# EAGLE design Buck Regulator_secondary (EAGLE 9.6.2)

## Sheet 1 of 2: Datasheet
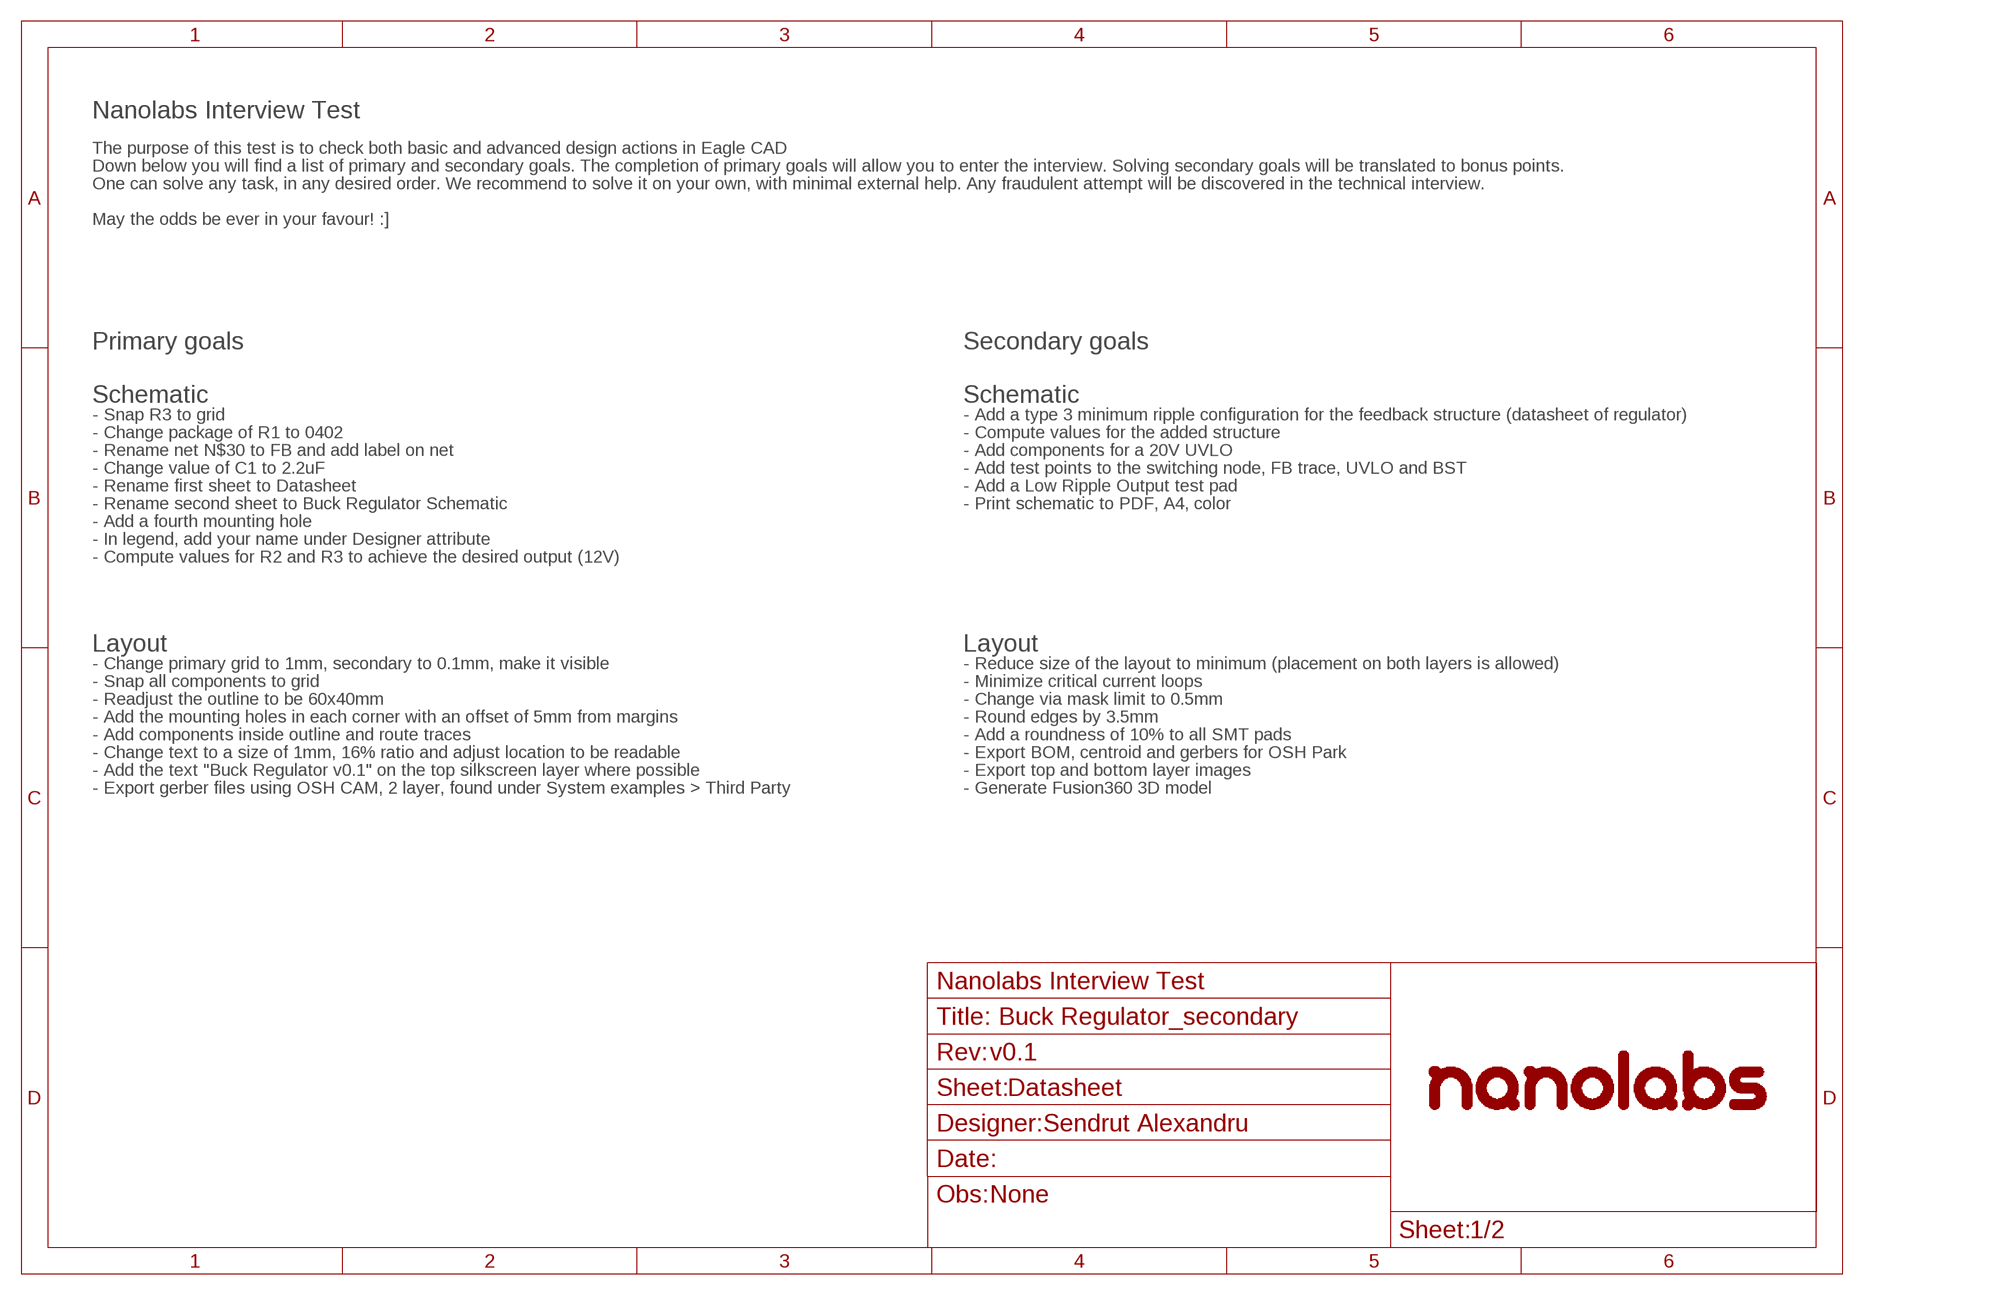
[diagram p0: schematic, sheet 1]
FRAME3 (_SCH_FRAME_A4): DNAME: Sendrut Alexandru; OBS: None; REVNUM: v0.1

### Notes on the sheet
- Nanolabs Interview Test
- The purpose of this test is to check both basic and advanced design actions in Eagle CAD
- Down below you will find a list of primary and secondary goals. The completion of primary goals will allow you to enter the interview. Solving secondary goals will be translated to bonus points.
- One can solve any task, in any desired order. We recommend to solve it on your own, with minimal external help. Any fraudulent attempt will be discovered in the technical interview.
- May the odds be ever in your favour! :]
- Primary goals | Secondary goals
- Schematic | Schematic
- - Snap R3 to grid | - Add a type 3 minimum ripple configuration for the feedback structure (datasheet of regulator)
- - Change package of R1 to 0402 | - Compute values for the added structure
- - Rename net N$30 to FB and add label on net | - Add components for a 20V UVLO
- - Change value of C1 to 2.2uF | - Add test points to the switching node, FB trace, UVLO and BST
- - Rename first sheet to Datasheet | - Add a Low Ripple Output test pad
- - Rename second sheet to Buck Regulator Schematic | - Print schematic to PDF, A4, color
- - Add a fourth mounting hole
- - In legend, add your name under Designer attribute
- - Compute values for R2 and R3 to achieve the desired output (12V)
- Layout | Layout
- - Change primary grid to 1mm, secondary to 0.1mm, make it visible | - Reduce size of the layout to minimum (placement on both layers is allowed)
- - Snap all components to grid | - Minimize critical current loops
- - Readjust the outline to be 60x40mm | - Change via mask limit to 0.5mm
- - Add the mounting holes in each corner with an offset of 5mm from margins | - Round edges by 3.5mm
- - Add components inside outline and route traces | - Add a roundness of 10% to all SMT pads
- - Change text to a size of 1mm, 16% ratio and adjust location to be readable | - Export BOM, centroid and gerbers for OSH Park
- - Add the text "Buck Regulator v0.1" on the top silkscreen layer where possible | - Export top and bottom layer images
- - Export gerber files using OSH CAM, 2 layer, found under System examples > Third Party | - Generate Fusion360 3D model

## Sheet 2 of 2: Buck Regulator Schematic
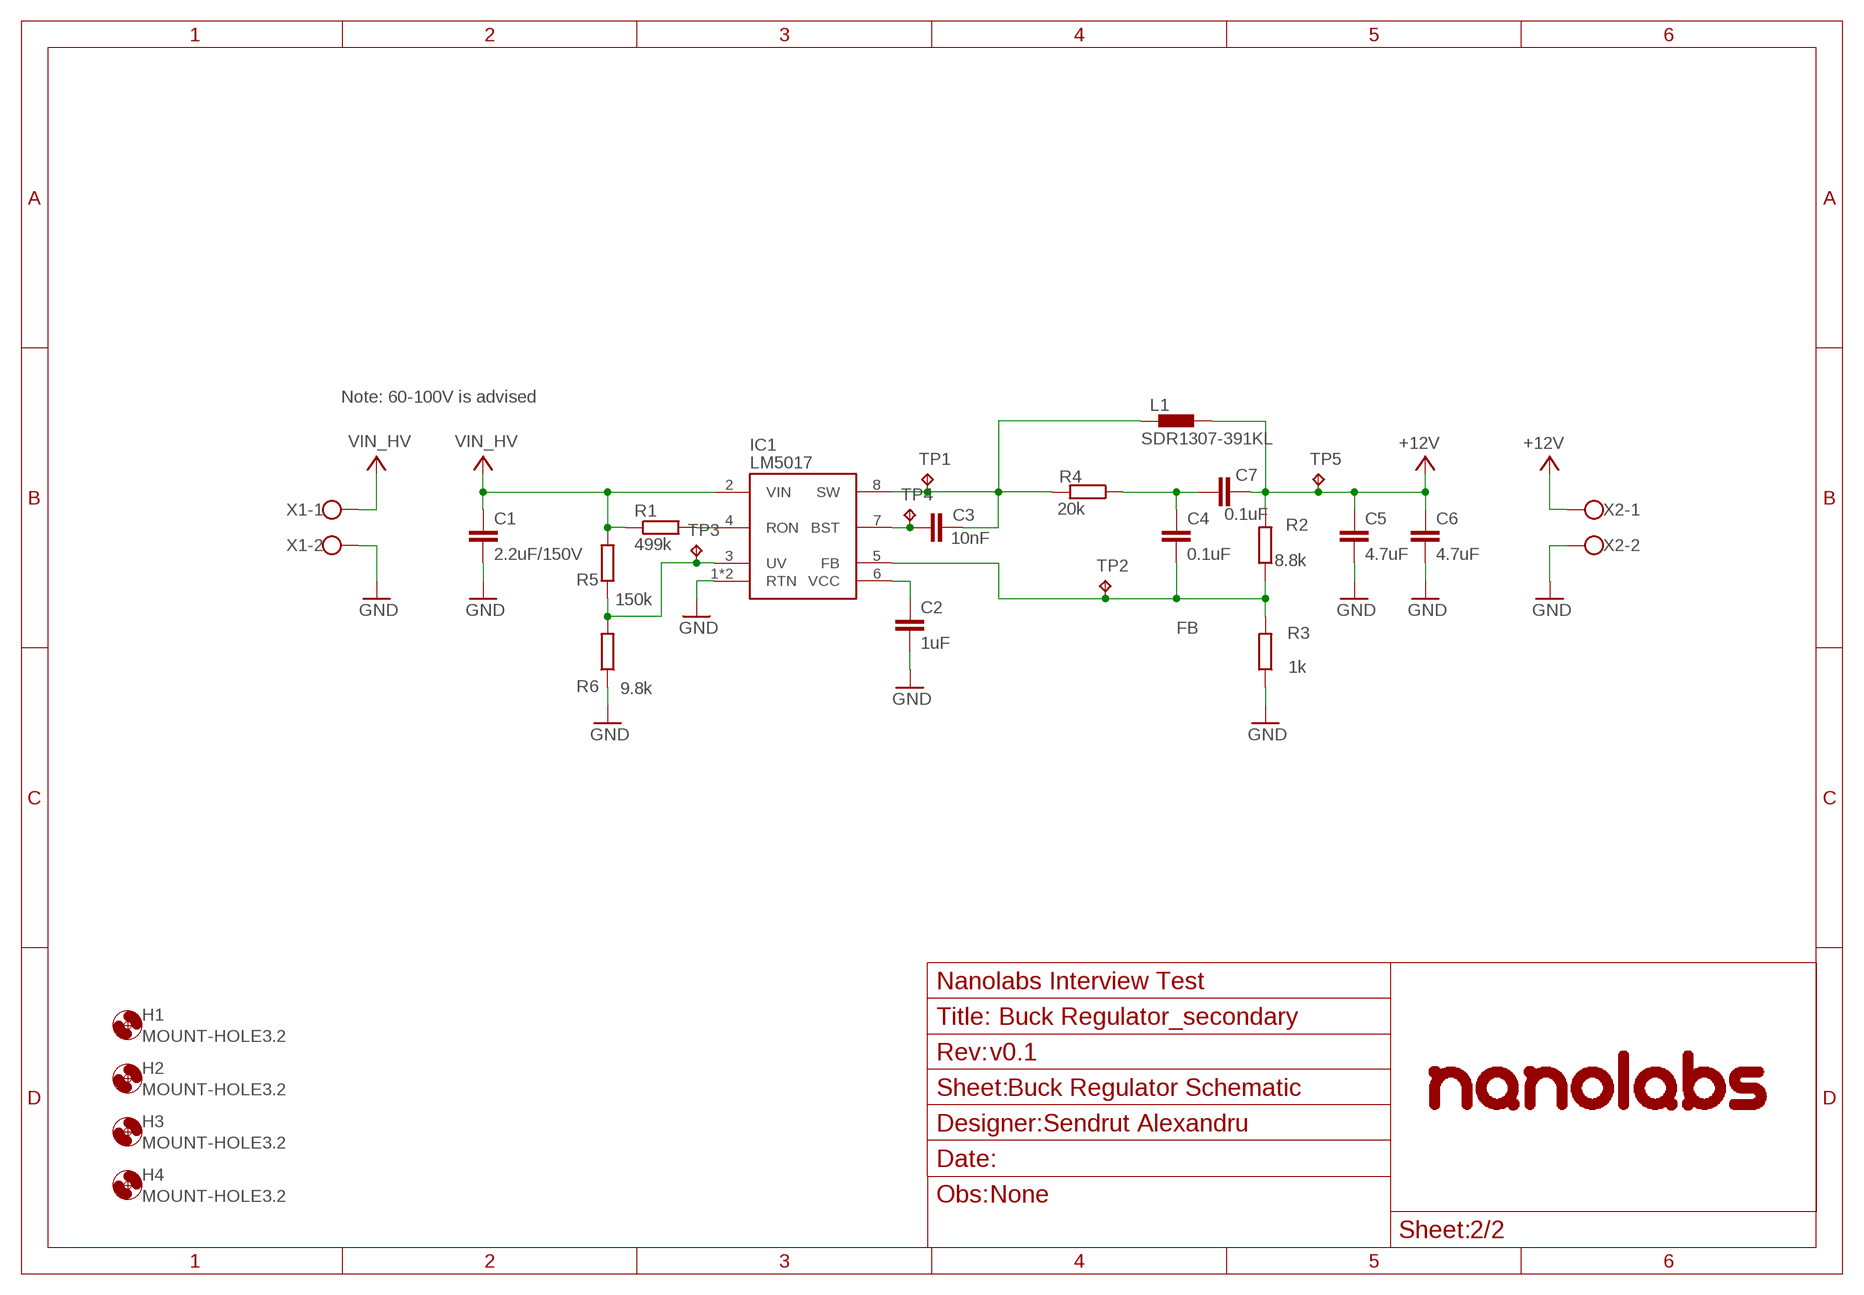
[diagram p1: schematic, sheet 2]
FRAME1 (_SCH_FRAME_A4): DNAME: Sendrut Alexandru; OBS: None; REVNUM: v0.1

### Parts
C1  2.2uF/150V  C-EUC1812  [C1812]
C2  1uF  C-EUC0603  [C0603]
C3  10nF  C-EUC0603  [C0603]
C4  0.1uF  C-EUC0603  [C0603]
C5  4.7uF  C-EUC0603  [C0603]
C6  4.7uF  C-EUC0603  [C0603]
C7  0.1uF  C-EUC0603  [C0603]
H1  MOUNT-HOLE3.2  [3,2]
H2  MOUNT-HOLE3.2  [3,2]
H3  MOUNT-HOLE3.2  [3,2]
H4  MOUNT-HOLE3.2  [3,2]
IC1  LM5017  [SO-08-EP]
L1  SDR1307-391KL  [SDR1307-391KL]
R1  499k  R-EU_R0402  [R0402]
R2  8.8k  R-EU_R0603  [R0603]
R3  1k  R-EU_R0603  [R0603]
R4  20k  R-EU_R0603  [R0603]
R5  150k  R-EU_R0402  [R0402]
R6  9.8k  R-EU_R0402  [R0402]
TP1  TPB1,27  [B1,27]
TP2  TPB1,27  [B1,27]
TP3  TPB1,27  [B1,27]
TP4  TPB1,27  [B1,27]
TP5  TPB1,27  [B1,27]
X1  W237-102  [W237-102]
X2  W237-102  [W237-102]

### Nets
+12V: C5.1 C6.1 C7.2 L1.2 R2.2 TP5.TP X2.1
FB: C4.2 IC1.5(FB) R2.1 R3.2 TP2.TP
GND: C1.2 C2.2 C5.2 C6.2 IC1.1(RTN) IC1.9(RTN) R3.1 R6.1 X1.2 X2.2
N$1: C4.1 C7.1 R4.1
N$2: IC1.3(UV) R5.1 R6.2 TP3.TP
N$23: C2.1 IC1.6(VCC)
N$28: C3.1 IC1.7(BST) TP4.TP
N$29: C3.2 IC1.8(SW) L1.1 R4.2 TP1.TP
N$31: IC1.4(RON) R1.2
VIN_HV: C1.1 IC1.2(VIN) R1.1 R5.2 X1.1

### Notes on the sheet
- Note: 60-100V is advised

## Library data of the parts
C1-C7 = rcl:C-EU: CAPACITOR, European symbol; SPICEPREFIX: C
H1-H4 = _nanolabs_layout:MOUNT-HOLE: MOUNTING HOLE with drill center marker
IC1 = _nanolabs_ic:LM5017
L1 = _nanolabs_rcl:SDR1307-391KL
R1-R6 = rcl:R-EU_: RESISTOR, European symbol; SPICEPREFIX: R
TP1-TP5 = testpad:TP: Test pad
X1 X2 = con-wago-500:W237-102: WAGO SCREW CLAMP; MPN: 237-102; OC_FARNELL: unknown; OC_NEWARK: 70K9898

## Board
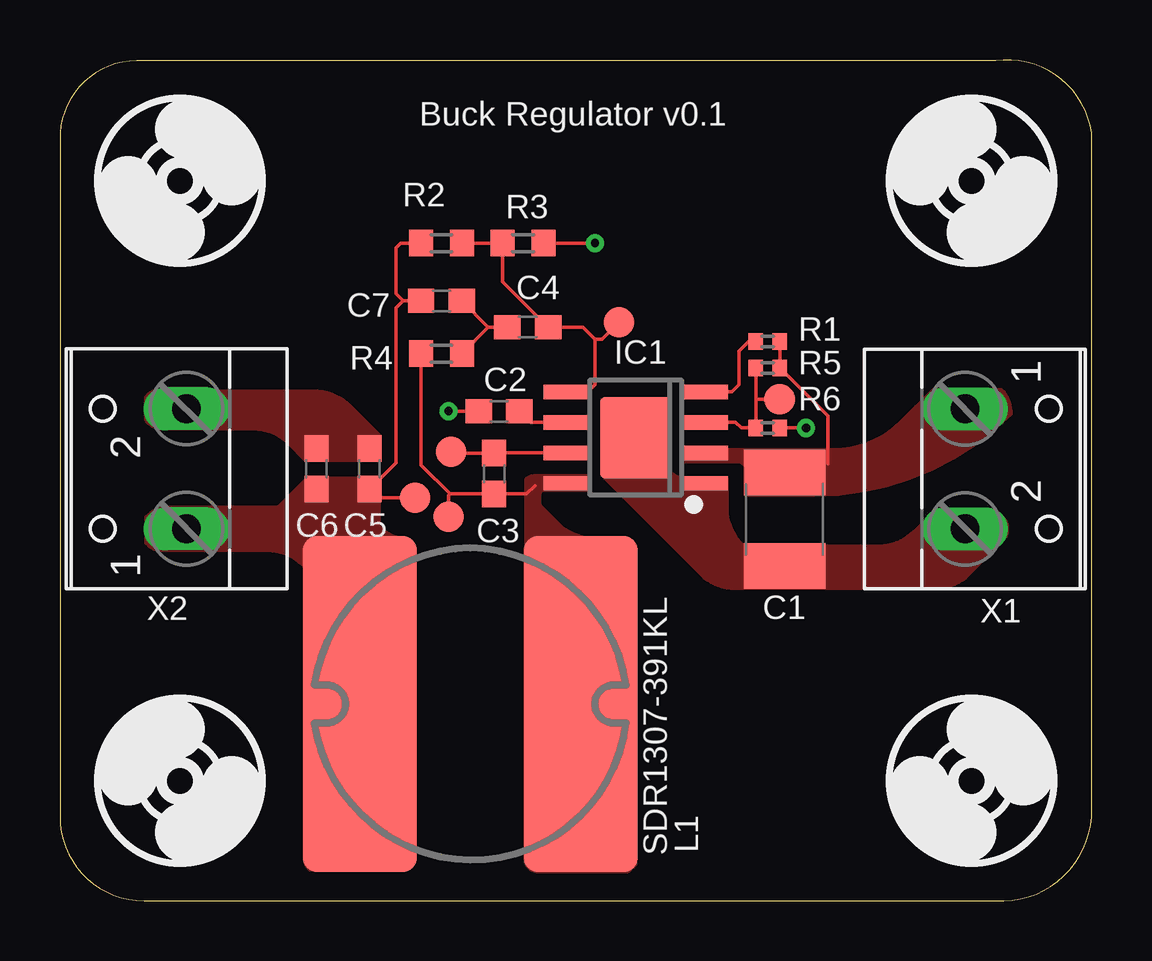
[diagram p2: board, top side]
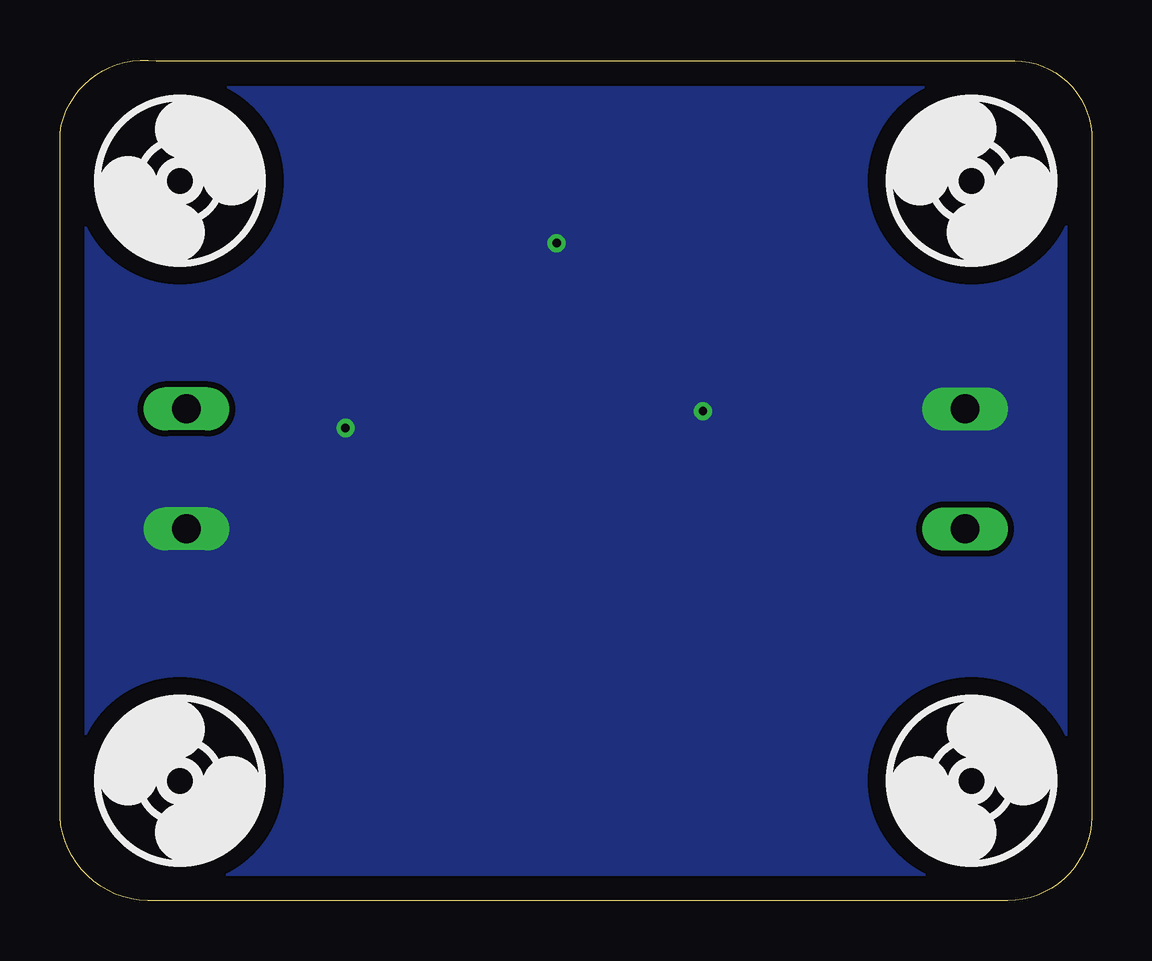
[diagram p3: board, bottom side, seen from below]

Size 43 x 35.04 mm. Coordinates in mm from the lower left corner, seen from the top.
Outline: 0,32.01 0,3.51 arc90 3.5,0.01 39,0.01 arc90 43,3.51 43,32.01 arc90 39,35.01 3.5,35.01 arc90 0,32.01
Copper layers (1*16): Top 0.035mm / dielectric 1.5mm / Bottom 0.035mm
Design rules "default": minimum track width 6mil, minimum drill 0.35mm, track to track 6mil, track to pad 6mil, pad to pad 6mil, via to via 6mil, smd to smd 6mil, copper to edge 40mil, drill to drill 6mil, minimum pad ring 10mil, minimum via ring 8mil, stop-mask expansion 4mil, vias tented up to drill 0mil, thermal gap 10mil

### Footprints (pad centres in the part's own frame; a part is rotated, then mirrored left to right if it is on the bottom)
C1812 = smd 1.9 x 3.4: 1 -1.95,0; 2 1.95,0
C0603 = smd 1.1 x 1: 1 -0.85,0; 2 0.85,0
3,2 = hole 3.2: 0,0
SO-08-EP = smd 0.6 x 1.9: 1 -1.905,-2.9; 2 -0.635,-2.9; 3 0.635,-2.9; 4 1.905,-2.9; 5 1.905,2.9; 6 0.635,2.9; 7 -0.635,2.9; 8 -1.905,2.9 | smd 3.4 x 2.95: 9 0,0
SDR1307-391KL = smd 14 x 4.75: 1 0,4.6; 2 0,-4.6
R0402 = smd 0.6 x 0.7: 1 -0.5,0; 2 0.5,0
R0603 = smd 1 x 1.1: 1 -0.85,0; 2 0.85,0
B1,27 = smd 1.27 x 1.27: TP 0,0
W237-102 = drill 1.194 long: 1 -2.5,-1.27; 2 2.5,-1.27

### Placement (x,y rotation side)
C1  30.2,15.91 270 top
C2  18.3,20.41 180 top
C3  18.1,17.81 270 top
C4  19.5,23.91 0 top
C5  12.9,18.01 90 top
C6  10.7,18.01 90 top
C7  15.9,25.01 180 top
H1  5,30.01 90 bottom
H2  5,5.01 90 top
H3  38,5.01 270 bottom
H4  38,30.01 0 bottom
IC1  24,19.31 90 top
L1  17.1,8.21 270 top
R1  29.5,23.31 180 top
R2  15.9,27.41 180 top
R3  19.3,27.41 180 top
R4  15.9,22.81 180 top
R5  29.5,22.21 0 top
R6  29.5,19.71 180 top
TP1  16.2,16.01 0 top
TP2  23.3,24.11 0 top
TP3  30,20.91 0 top
TP4  16.3,18.71 0 top
TP5  14.8,16.81 0 top
X1  39,18.01 270 top
X2  4,18.01 90 top

### Tracks (layer width: path | path; a pad name or v marks a point on that pad's centre or on a via)
+12V
  Top 0.152: TP5.TP 13.25,16.81 C5.1 14,18.26 14,24.71 14.3,25.01 | C7.2 14.3,25.01 | 14.3,25.01 14,25.31 14,27.21 14.2,27.41 R2.2
  pour Top (no thermals): 13.3,17.61 13.3,15.61 13.38,15.53 arc45 14.4,15.11 arc-45 14.57,15.04 14.7,14.91 arc-45 14.8,14.67 14.8,1.89 arc-45 14.6,1.41 arc-45 14.36,1.31 10.4,1.31 arc-45 10.2,1.79 10.2,13.91 10.09,14.02 arc45 8.67,14.61 4.22,14.61 arc-45 3.68,14.83 3.6,14.91 3.6,16.01 arc-45 4.57,16.41 9.1,16.41 10.3,17.61
FB
  Top 0.152: IC1.5 22,21.21 22.3,21.51 22.3,23.41 | 22.3,23.41 21.8,23.91 C4.2 18.45,25.81 R3.2 R2.1 | TP2.TP 22.6,23.41 22.3,23.41
GND  (via drill 0.35)
  Top 0.152: 24,20.21 23.9,20.31 23.9,20.51 24.1,20.71 | R6.1 v31.1,19.71 | C2.2 v16.2,20.41 | R3.1 v22.3,27.41
  pour Bottom (isolate 0.254, no thermals): 1,7.01 1,29.01 arc-90 6,34.01 37,34.01 arc-90 42,30.01 42,6.01 arc-90 36,1.01 7,1.01 arc-90
  pour Top (no thermals): 4,21.31 10.57,21.31 arc-45 12.16,20.65 13.4,19.41 13.4,18.31 10.2,18.31 9.49,19.02 arc45 8.07,19.61 4.32,19.61 arc-45 3.6,19.91 arc-45 3.5,20.15 3.5,21.01 3.66,21.17 arc-45
  pour Top (no thermals): 25.3,20.91 arc-45 25.4,20.67 25.4,17.91 arc45 26.12,17.61 27.8,17.61 27.8,16.34 arc45 28.39,14.92 28.5,14.81 34.17,14.81 arc45 35.59,15.39 36.4,16.21 arc-45 36.64,16.31 39,16.31 39.29,16.02 arc-45 39.5,15.51 arc-45 39.29,14.99 39.1,14.81 37.89,13.59 arc-45 36.47,13.01 28.5,13.01 28.13,13.01 arc-45 26.71,13.59 22.6,17.71 22.6,20.91
N$1
  Top 0.152: 16.8,25.01 C7.1 17.85,23.91 | 16.8,22.86 R4.1 17.85,23.91 | 17.85,23.91 C4.1
N$2
  Top 0.152: R5.1 29,20.91 | 29,20.91 R6.2 28.4,19.71 28.16,19.94 IC1.3 | TP3.TP 29,20.91
N$23
  Top 0.152: IC1.6 19.61,19.94 C2.1
N$28
  Top 0.152: IC1.7 18.29,18.67 C3.1 16.35,18.66 TP4.TP
N$29
  Top 0.152: IC1.8 | 19.8,17.31 19.45,16.96 C3.2 16.25,16.96 | R4.2 15.05,18.16 16.25,16.96 | 16.25,16.96 16.2,16.91 TP1.TP
  pour Top (no thermals): 22,17.71 19.77,17.71 arc45 19.4,17.56 19.4,1.65 arc45 19.5,1.41 arc45 19.98,1.21 23.6,1.21 arc45 23.77,1.28 24,1.51 24,14.67 arc45 23.9,14.91 23.77,15.04 arc45 23.6,15.11 22.23,15.11 arc-45 20.81,15.69 20,16.51 20,16.87 arc-45 20.1,17.11 22,17.11
N$31
  Top 0.152: IC1.4 28,21.21 28.3,21.51 28.3,22.91 28.7,23.31 R1.2
VIN_HV
  Top 0.152: R1.1 R5.2 32,20.21 32,18.21
  pour Top (no thermals): 26,18.31 28.26,18.31 arc-45 28.5,18.21 arc-45 28.6,17.97 28.6,16.91 31.44,16.91 arc45 39.65,20.31 arc45 39.23,21.31 36.4,21.31 35.03,19.94 arc-45 32.3,18.81 26,18.81

### Text on the board
tNames: Buck Regulator v0.1